# EAGLE design power_supply-TPS54531 (EAGLE 9.2.2)
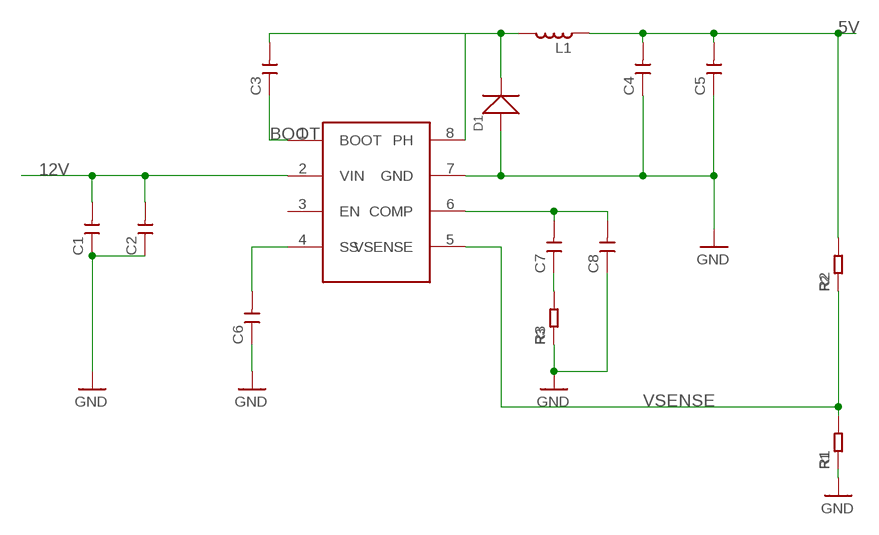
[diagram p0: schematic, sheet 1]

## Parts
C1  CAP-CERAMIC-SMD0805  [0805]
C2  CAP-CERAMIC-SMD0805  [0805]
C3  CAP-CERAMIC-SMD0805  [0805]
C4  CAP-CERAMIC-SMD0805  [0805]
C5  CAP-CERAMIC-SMD0805  [0805]
C6  CAP-CERAMIC-SMD0805  [0805]
C7  CAP-CERAMIC-SMD0805  [0805]
C8  CAP-CERAMIC-SMD0805  [0805]
D1  SMD-DIODE-SCHOTTKY-28V-5A(DO-214AA)DO-214AC  [SMA-DO214AC]
L1  IND-TDK-SPM6530T  [IND_TDK_7.1X6.5]
R1  RES-SMD-0805  [0805]
R2  RES-SMD-0805  [0805]
R3  RES-SMD-0805  [0805]
U$1  TPS54531SOIC8  [SOIC8]

## Nets
5V: C4.2 C5.2 L1.1 R2.2
12V: C1.2 C2.2 U$1.2(VIN)
BOOT: C3.1 U$1.1(BOOT)
GND: C1.1 C2.1 C4.1 C5.1 C6.1 C8.1 D1.A(+) R1.1 R3.1 U$1.7(GND)
N$2: C3.2 D1.K(-) L1.2 U$1.8(PH)
N$3: C6.2 U$1.4(SS)
N$4: C7.1 R3.2
N$5: C7.2 C8.2 U$1.6(COMP)
VSENSE: R1.2 R2.1 U$1.5(VSENSE)
Unconnected: U$1.3(EN)

## Library data of the parts
C1-C8 = RoverWing-V1.5:CAP-CERAMIC-SMD: CAP CERAMIC, SMD
D1 = RoverWing-V1.5:SMD-DIODE-SCHOTTKY-28V-5A(DO-214AA): Schottky diode, 40V, 5A, DO-214; MANUFACTURER: Comchip Technologies; PARTNO: CDBA540-HF
L1 = RoverWing-V1.5:IND-TDK-SPM6530T: Power inductor, SMD, 4.7uH, 5.2A Manufacturer: TDK; MANUFACTURER: TDK; PARTNO: SPM6530T-4R7M
R1-R3 = RoverWing-V1.5:RES-SMD-0805
U$1 = RoverWing-V1.5:TPS54531; MANUFACTURER: TEXAS INSTRUMENTS; PARTNO: TPS54531DDAR

## Board
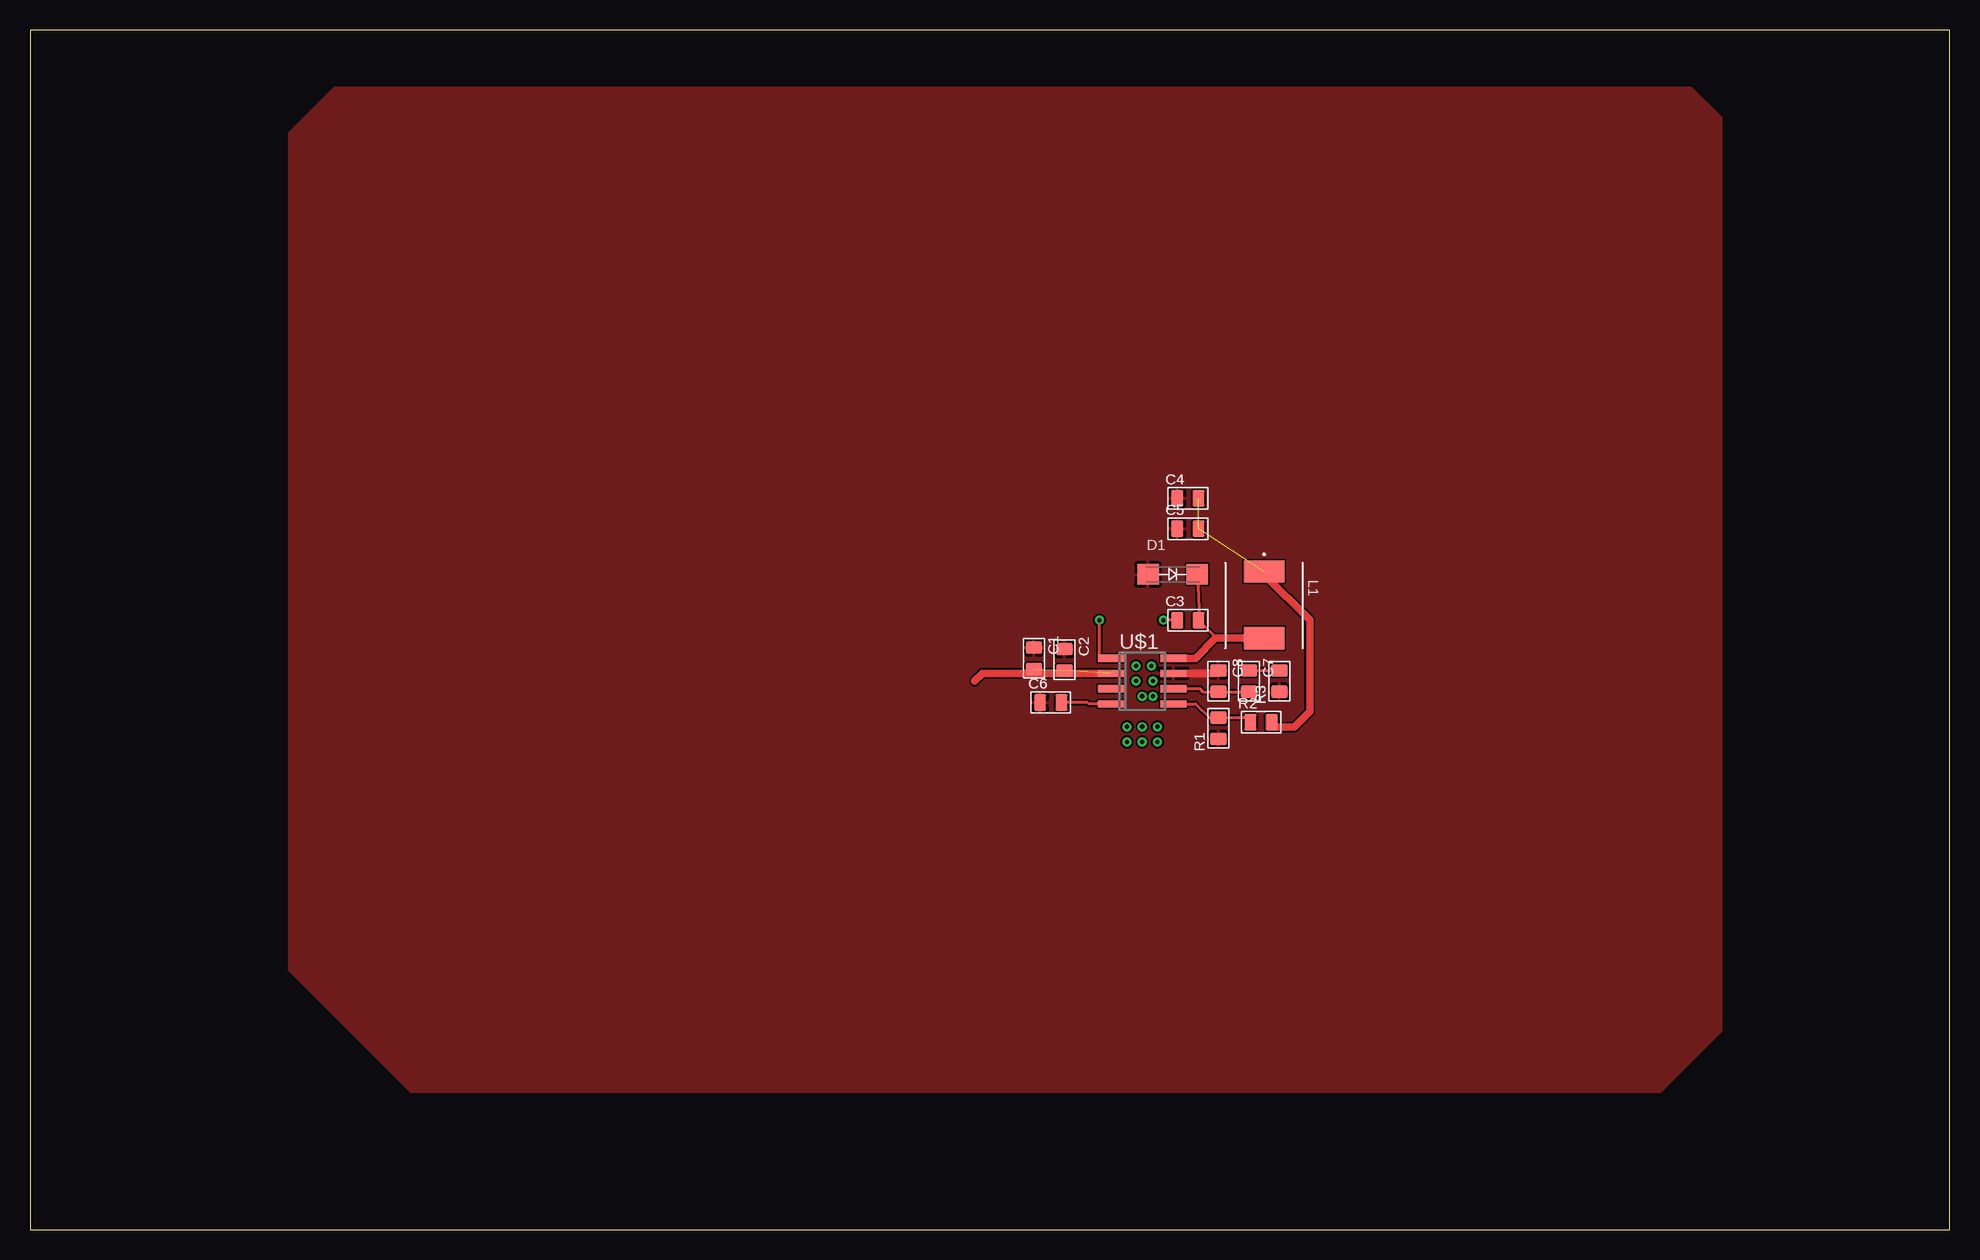
[diagram p1: board, top side]
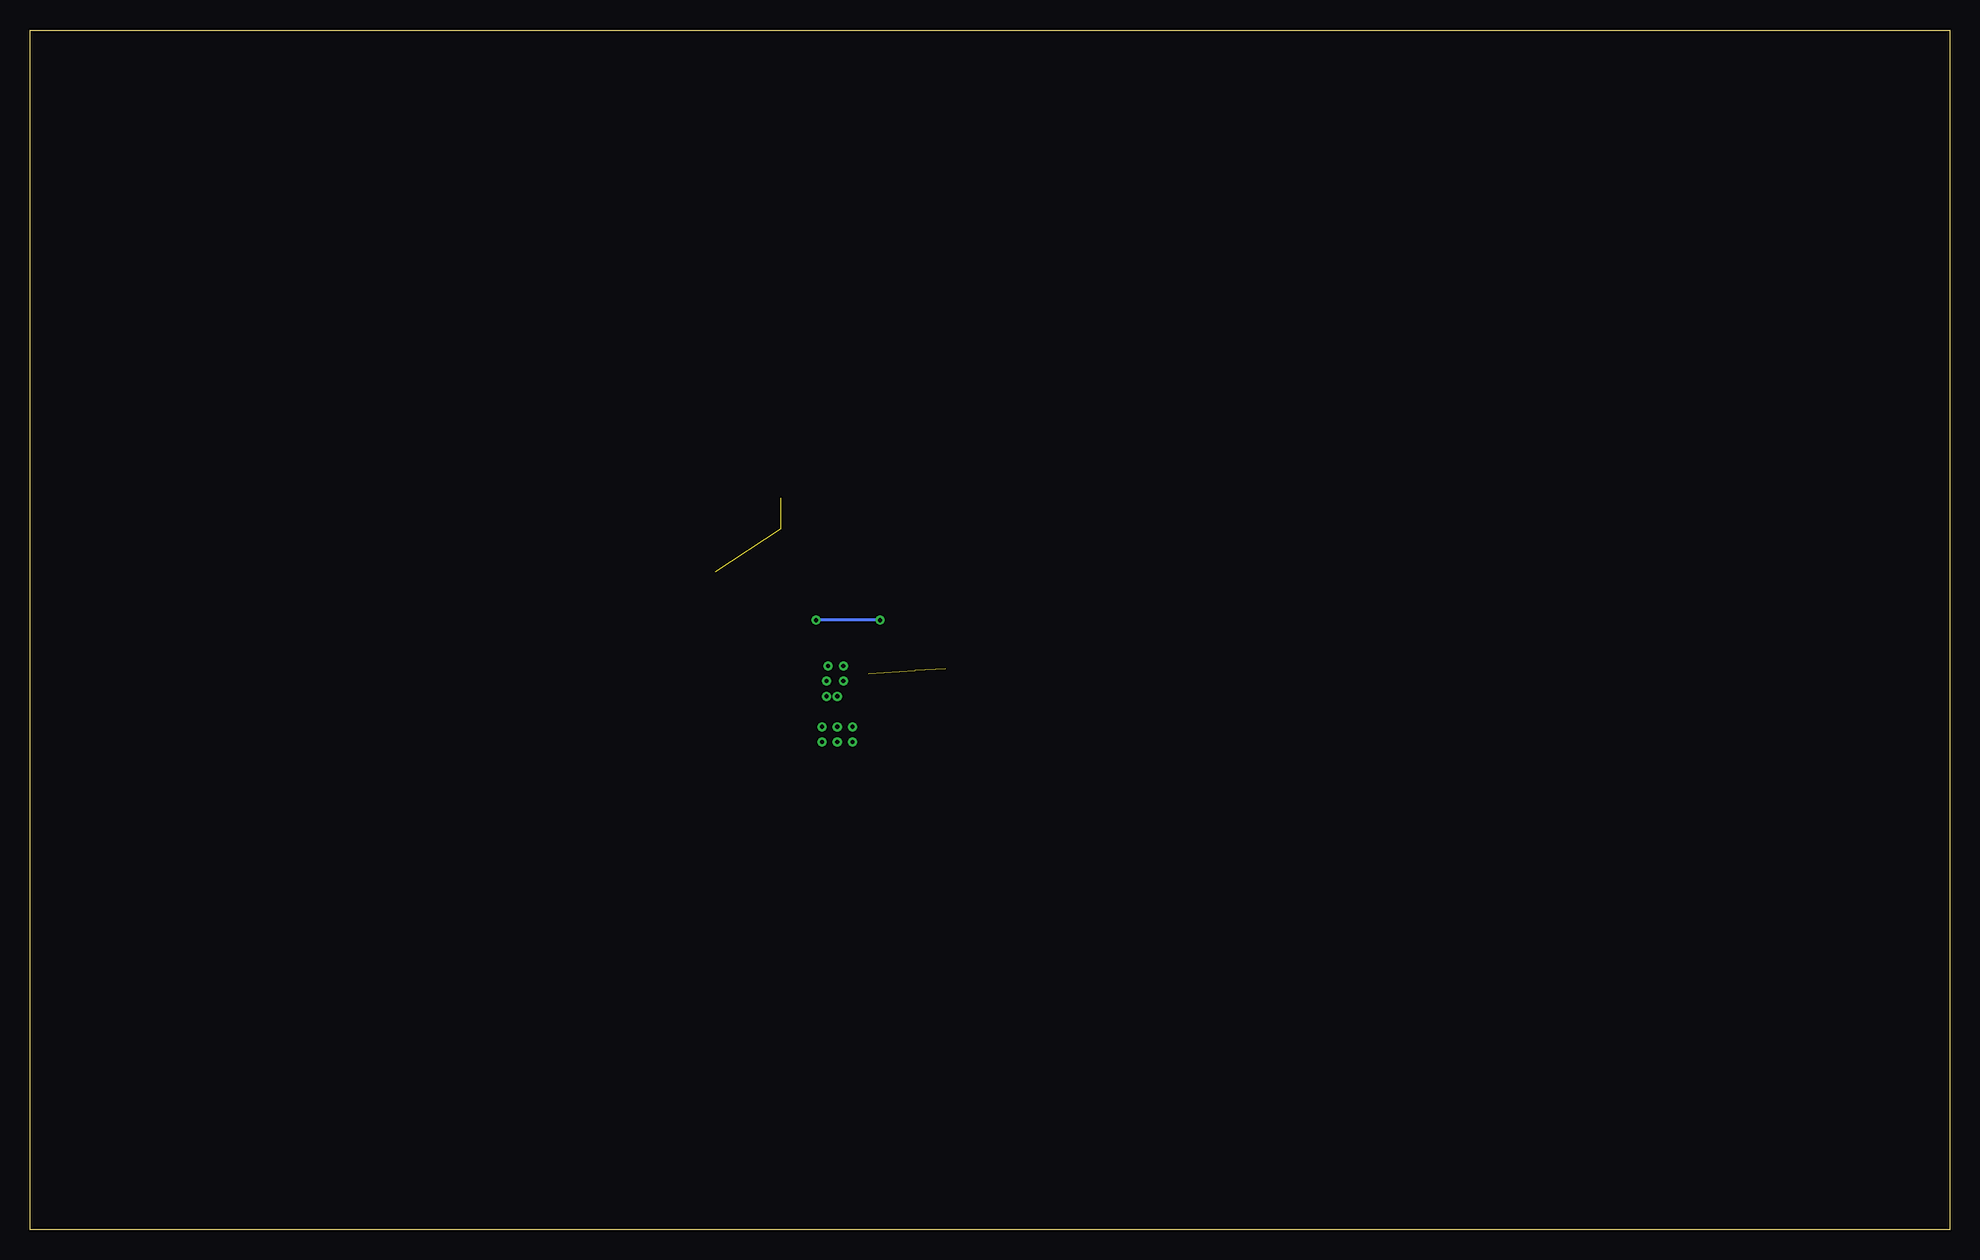
[diagram p2: board, bottom side, seen from below]

Size 160 x 100 mm. Coordinates in mm from the lower left corner, seen from the top.
Outline: 0,0 160,0 160,100 0,100 0,0
Copper layers (1*16): Top 0.035mm / dielectric 1.5mm / Bottom 0.035mm
Design rules "default": minimum track width 6mil, minimum drill 0.35mm, track to track 6mil, track to pad 6mil, pad to pad 6mil, via to via 6mil, smd to smd 6mil, copper to edge 40mil, drill to drill 6mil, minimum pad ring 10mil, minimum via ring 8mil, stop-mask expansion 4mil, vias tented up to drill 0mil, thermal gap 10mil

### Footprints (pad centres in the part's own frame; a part is rotated, then mirrored left to right if it is on the bottom)
0805 = smd 1.016 x 1.397: 1 -0.889,0; 2 0.889,0
SMA-DO214AC = smd 1.8 x 1.7: A -2.05,0; K 2.05,0
IND_TDK_7.1X6.5 = smd 1.85 x 3.4: 1 -2.775,0; 2 2.775,0
SOIC8 = smd 0.6 x 2.2: 1 -1.905,-2.6; 2 -0.635,-2.6; 3 0.635,-2.6; 4 1.905,-2.6; 5 1.905,2.6; 6 0.635,2.6; 7 -0.635,2.6; 8 -1.905,2.6

### Placement (x,y rotation side)
C1  83.69,47.62 270 top
C2  86.23,47.5 270 top
C3  96.52,50.8 0 top
C4  96.52,60.96 0 top
C5  96.52,58.42 0 top
C6  85.09,43.94 0 top
C7  101.6,45.72 270 top
C8  99.06,45.72 270 top
D1  95.25,54.61 0 top
L1  102.87,52.07 270 top
R1  99.06,41.78 90 top
R2  102.62,42.29 0 top
R3  104.14,45.72 90 top
U$1  92.71,45.72 270 top

### Tracks (layer width: path | path; a pad name or v marks a point on that pad's centre or on a via)
5V  (2 unrouted)
  Top 0.61: R2.2 103.89,41.91 105.41,41.91 106.68,43.18 106.68,50.8 102.87,54.61 L1.1
12V  (2 unrouted)
  Top 0.61: U$1.2 79.38,46.35 78.74,45.72
BOOT  (via drill 0.35)
  Top 0.254: U$1.1 89.28,47.62 89.15,47.5 v89.15,50.8 | C3.1 v94.49,50.8
  Bottom 0.254: v89.15,50.8 v94.49,50.8
GND
  Top 0.61: U$1.7 98.81,46.35 C8.1
  pour Top: 138.43,95.25 140.97,92.71 140.97,16.51 135.89,11.43 31.75,11.43 21.59,21.59 21.59,91.44 25.4,95.25 34.29,95.25
N$1  (via drill 0.35)
  other vias: 91.44,41.91
N$2
  Top 0.254: 98.83,49.3 98.83,49.38 C3.2 97.46,50.85 D1.K
  Top 0.61: U$1.8 97.16,47.62 98.83,49.3 L1.2
N$3
  Top 0.254: C6.2 88.14,43.94 88.27,43.81 U$1.4
N$4
  Top 0.254: C7.1 R3.2
N$5
  Top 0.254: U$1.6 97.54,45.09 97.79,44.83 C8.2 C7.2
N$6  (via drill 0.35)
  other vias: 93.98,41.91
N$7  (via drill 0.35)
  other vias: 92.71,41.91
N$8  (via drill 0.35)
  other vias: 91.44,40.64
N$9  (via drill 0.35)
  other vias: 92.71,40.64
N$10  (via drill 0.35)
  other vias: 93.98,40.64
N$11  (via drill 0.35)
  other vias: 92.71,44.45
N$12  (via drill 0.35)
  other vias: 92.2,45.72
N$13  (via drill 0.35)
  other vias: 92.2,46.99
N$14  (via drill 0.35)
  other vias: 93.47,46.99
N$15  (via drill 0.35)
  other vias: 93.6,45.72
N$16  (via drill 0.35)
  other vias: 93.6,44.45
VSENSE
  Top 0.254: U$1.5 97.16,43.81 98.3,42.67 R1.2 101.35,42.67 R2.1